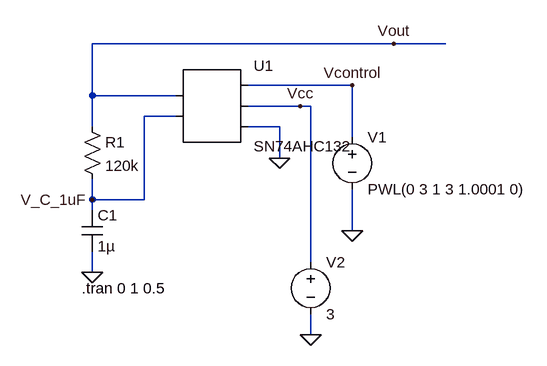
[diagram p0: schematic FES Clock Generation and Control.asc]
* FES Clock Generation and Control.asc
* U1: SN74AHC132 (symbol AutoGenerated\SN74AHC132 not available, pins judged from their places): pin1=Vout pin2=V_C_1uF pin3=Vcontrol pin4=Vcc pin5=0
C1 V_C_1uF 0 1µ
R1 Vout V_C_1uF 120k
V1 Vcontrol 0 PWL(0 3 1 3 1.0001 0)
V2 Vcc 0 3
.tran 0 1 0.5
.backanno
.end

* Results of the author's LTspice run, read from the files saved beside the schematic
* Operating Point, zero values left out:
*   V(v_c_1uf) = 908.4 mV
*   V(vcontrol) = 3 V
*   V(vcc) = 3 V
*   V(vout) = 680.8 µV
*   I(C1) = -8.473 µA
*   I(R1) = -7.565 µA
*   I(V1) = -3.001 µA
*   I(V2) = -387.3 µA
*   Ix(u1:Y) = 7.565 µA
*   Ix(u1:A) = 908.8 nA
*   Ix(u1:B) = 3.001 µA
*   Ix(u1:VCC) = 387.3 µA
*   Ix(u1:AGND) = -398.8 µA
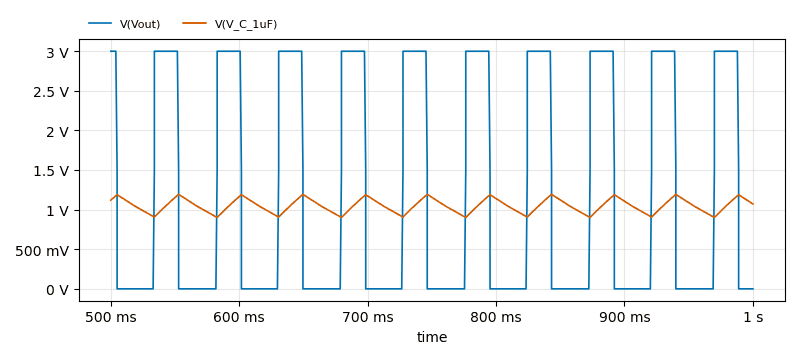
[diagram p1: Transient Analysis of FES Clock Generation and Control.asc, plotted from the saved traces]
* Transient Analysis, 1 run:
*   V(Vout): min 681.8 µV, max 2.998 V, average 1.161 V, rms 1.853 V, last 803 µV
*   V(V_C_1uF): min 901.5 mV, max 1.193 V, average 1.049 V, rms 1.053 V, last 1.071 V